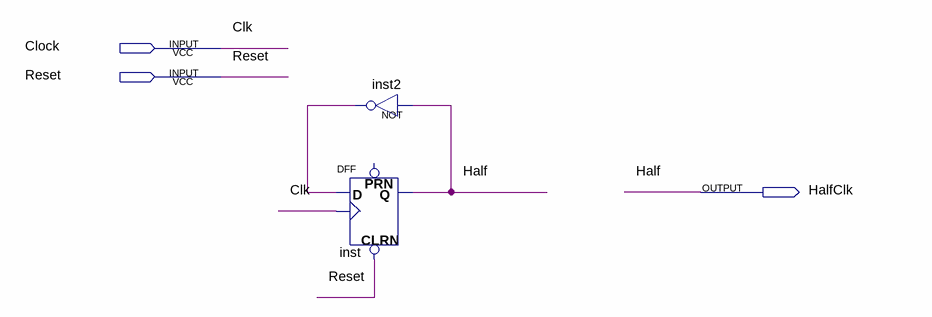
[diagram p0: schematic sheet]
// Quartus schematic ClockDiv.bdf as structural Verilog: 2 symbols, 3 pins
module ClockDiv (
  input  Clock,
  input  Reset,
  output HalfClk
);

  wire inst2_out;

  not inst2 (inst2_out, HalfClk);
  DFF inst (.CLRN(Reset), .CLK(Clock), .D(inst2_out), .Q(HalfClk));  // open: PRN

  // Other names for the same wires on the sheet: Clk = Clock; Half = HalfClk
endmodule
